# EAGLE schematic keeboartouch (EAGLE 9.6.2)

## Sheet 1 of 3
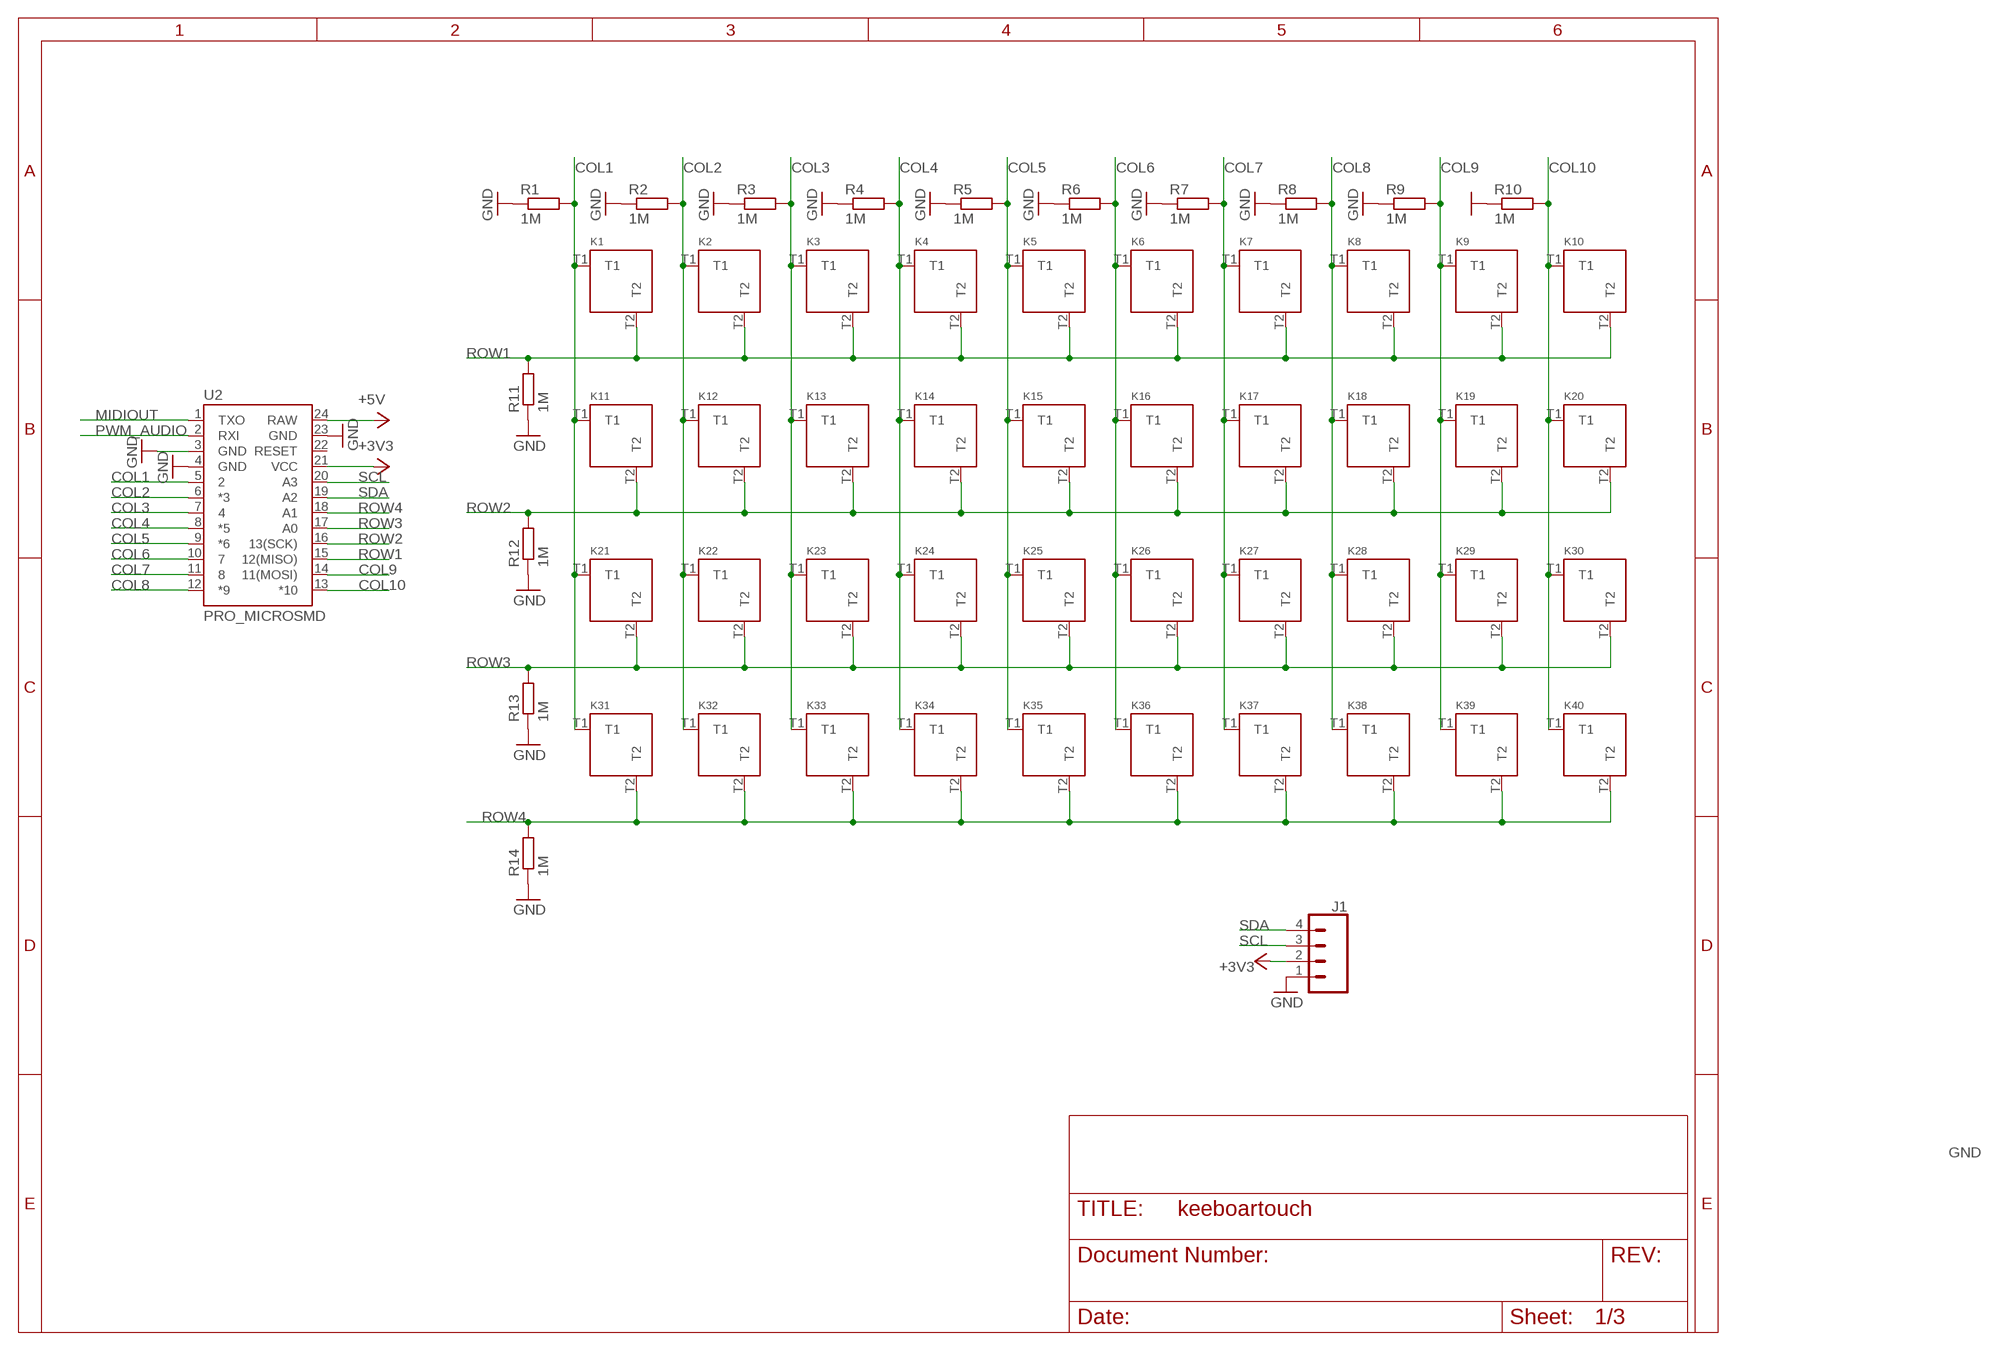
[diagram p0: schematic, sheet 1]

### Parts
J1  CONN_04  [1X04]
K1  TOUCHKEY  [TOUCHPAD_KEY_0.5IN]
K2  TOUCHKEY  [TOUCHPAD_KEY_0.5IN]
K3  TOUCHKEY  [TOUCHPAD_KEY_0.5IN]
K4  TOUCHKEY  [TOUCHPAD_KEY_0.5IN]
K5  TOUCHKEY  [TOUCHPAD_KEY_0.5IN]
K6  TOUCHKEY  [TOUCHPAD_KEY_0.5IN]
K7  TOUCHKEY  [TOUCHPAD_KEY_0.5IN]
K8  TOUCHKEY  [TOUCHPAD_KEY_0.5IN]
K9  TOUCHKEY  [TOUCHPAD_KEY_0.5IN]
K10  TOUCHKEY  [TOUCHPAD_KEY_0.5IN]
K11  TOUCHKEY  [TOUCHPAD_KEY_0.5IN]
K12  TOUCHKEY  [TOUCHPAD_KEY_0.5IN]
K13  TOUCHKEY  [TOUCHPAD_KEY_0.5IN]
K14  TOUCHKEY  [TOUCHPAD_KEY_0.5IN]
K15  TOUCHKEY  [TOUCHPAD_KEY_0.5IN]
K16  TOUCHKEY  [TOUCHPAD_KEY_0.5IN]
K17  TOUCHKEY  [TOUCHPAD_KEY_0.5IN]
K18  TOUCHKEY  [TOUCHPAD_KEY_0.5IN]
K19  TOUCHKEY  [TOUCHPAD_KEY_0.5IN]
K20  TOUCHKEY  [TOUCHPAD_KEY_0.5IN]
K21  TOUCHKEY  [TOUCHPAD_KEY_0.5IN]
K22  TOUCHKEY  [TOUCHPAD_KEY_0.5IN]
K23  TOUCHKEY  [TOUCHPAD_KEY_0.5IN]
K24  TOUCHKEY  [TOUCHPAD_KEY_0.5IN]
K25  TOUCHKEY  [TOUCHPAD_KEY_0.5IN]
K26  TOUCHKEY  [TOUCHPAD_KEY_0.5IN]
K27  TOUCHKEY  [TOUCHPAD_KEY_0.5IN]
K28  TOUCHKEY  [TOUCHPAD_KEY_0.5IN]
K29  TOUCHKEY  [TOUCHPAD_KEY_0.5IN]
K30  TOUCHKEY  [TOUCHPAD_KEY_0.5IN]
K31  TOUCHKEY  [TOUCHPAD_KEY_0.5IN]
K32  TOUCHKEY  [TOUCHPAD_KEY_0.5IN]
K33  TOUCHKEY  [TOUCHPAD_KEY_0.5IN]
K34  TOUCHKEY  [TOUCHPAD_KEY_0.5IN]
K35  TOUCHKEY  [TOUCHPAD_KEY_0.5IN]
K36  TOUCHKEY  [TOUCHPAD_KEY_0.5IN]
K37  TOUCHKEY  [TOUCHPAD_KEY_0.5IN]
K38  TOUCHKEY  [TOUCHPAD_KEY_0.5IN]
K39  TOUCHKEY  [TOUCHPAD_KEY_0.5IN]
K40  TOUCHKEY  [TOUCHPAD_KEY_0.5IN]
R1  1M  R-EU_R0805  [R0805]
R2  1M  R-EU_R0805  [R0805]
R3  1M  R-EU_R0805  [R0805]
R4  1M  R-EU_R0805  [R0805]
R5  1M  R-EU_R0805  [R0805]
R6  1M  R-EU_R0805  [R0805]
R7  1M  R-EU_R0805  [R0805]
R8  1M  R-EU_R0805  [R0805]
R9  1M  R-EU_R0805  [R0805]
R10  1M  R-EU_R0805  [R0805]
R11  1M  R-EU_R0805  [R0805]
R12  1M  R-EU_R0805  [R0805]
R13  1M  R-EU_R0805  [R0805]
R14  1M  R-EU_R0805  [R0805]
U2  PRO_MICROSMD  [PRO_MICRO_SMD]

### Nets
+3V3: J1.2 U2.21(VCC)
+5V: U2.24(RAW)
COL1: K1.T1 K11.T1 K21.T1 K31.T1 R1.2 U2.5
COL2: K2.T1 K12.T1 K22.T1 K32.T1 R2.2 U2.6(*3)
COL3: K3.T1 K13.T1 K23.T1 K33.T1 R3.2 U2.7
COL4: K4.T1 K14.T1 K24.T1 K34.T1 R4.2 U2.8(*5)
COL5: K5.T1 K15.T1 K25.T1 K35.T1 R5.2 U2.9(*6)
COL6: K6.T1 K16.T1 K26.T1 K36.T1 R6.2 U2.10
COL7: K7.T1 K17.T1 K27.T1 K37.T1 R7.2 U2.11
COL8: K8.T1 K18.T1 K28.T1 K38.T1 R8.2 U2.12(*9)
COL9: K9.T1 K19.T1 K29.T1 K39.T1 R9.2 U2.14(11(MOSI))
COL10: K10.T1 K20.T1 K30.T1 K40.T1 R10.2 U2.13(*10)
GND: J1.1 R1.1 R2.1 R3.1 R4.1 R5.1 R6.1 R7.1 R8.1 R9.1 R10.1 R11.1 R12.1 R13.1 R14.1 U2.3(GND) U2.4(GND) U2.23(GND)
MIDIOUT: U2.1(TXO)
PWM_AUDIO: U2.2(RXI)
ROW1: K1.T2 K2.T2 K3.T2 K4.T2 K5.T2 K6.T2 K7.T2 K8.T2 K9.T2 K10.T2 R11.2 U2.15(12(MISO))
ROW2: K11.T2 K12.T2 K13.T2 K14.T2 K15.T2 K16.T2 K17.T2 K18.T2 K19.T2 K20.T2 R12.2 U2.16(13(SCK))
ROW3: K21.T2 K22.T2 K23.T2 K24.T2 K25.T2 K26.T2 K27.T2 K28.T2 K29.T2 K30.T2 R13.2 U2.17(A0)
ROW4: K31.T2 K32.T2 K33.T2 K34.T2 K35.T2 K36.T2 K37.T2 K38.T2 K39.T2 K40.T2 R14.2 U2.18(A1)
SCL: J1.3 U2.20(A3)
SDA: J1.4 U2.19(A2)
Unconnected: U2.22(RESET)

## Sheet 2 of 3

## Sheet 3 of 3

## Library data of the parts
J1 = SparkFun-Connectors:CONN_04: Multi connection point. Often used as Generic Header-pin footprint for 0.1 inch spaced/style header connections On any of the 0.1 inch spaced packages, you can populate with these: Break Away Headers - Straight <https://www.sparkfun.com/products/116> (PRT-00116) Break Away Male Headers - Right Angle <https://www.sparkfun.com/products/553> (PRT-00553) Female Headers <https://www.sparkfun.com/products/115> (PRT-00115) Break Away Headers - Machine Pin <https://www.sparkfun.com/products/117> (PRT-00117) Break Away Female Headers - Swiss Machine Pin <https://www.sparkfun.com/products/743> (PRT-00743) For SCREWTERMINALS and SPRING TERMINALS visit here: Screw Terimnals on SparkFun.com <https://www.sparkfun.com/search/results?term=Screw+Terminals> (5mm/3.5mm/2.54mm spacing) This device is also useful as a general connection point to wire up your design to another part of your project. Our various solder wires solder well into these plated through hole pads. Hook-Up Wire - Assortment (Stranded, 22 AWG) <https://www.sparkfun.com/products/11375> (PRT-11375) Hook-Up Wire - Assortment (Solid Core, 22 AWG) <https://www.sparkfun.com/products/11367> (PRT-11367) View the entire wire category on our website here <https://www.sparkfun.com/categories/141> Special notes: Molex polarized connector foot print use with SKU : PRT-08231 with associated crimp pins and housings. 1MM SMD Version SKU: PRT-10208; PROD_ID: CONN-09696
K1-K40 = todstuff:TOUCHKEY
R1-R14 = rcl:R-EU_: RESISTOR, European symbol; SPICEPREFIX: R
U2 = pro-micro-todbot:PRO_MICRO: Pro Micro SparkFun Pro Micro compatible footprint. SparkFun Products: 3.3V/8MHz <https://www.sparkfun.com/products/12587> 5V/16MHz <https://www.sparkfun.com/products/12640>